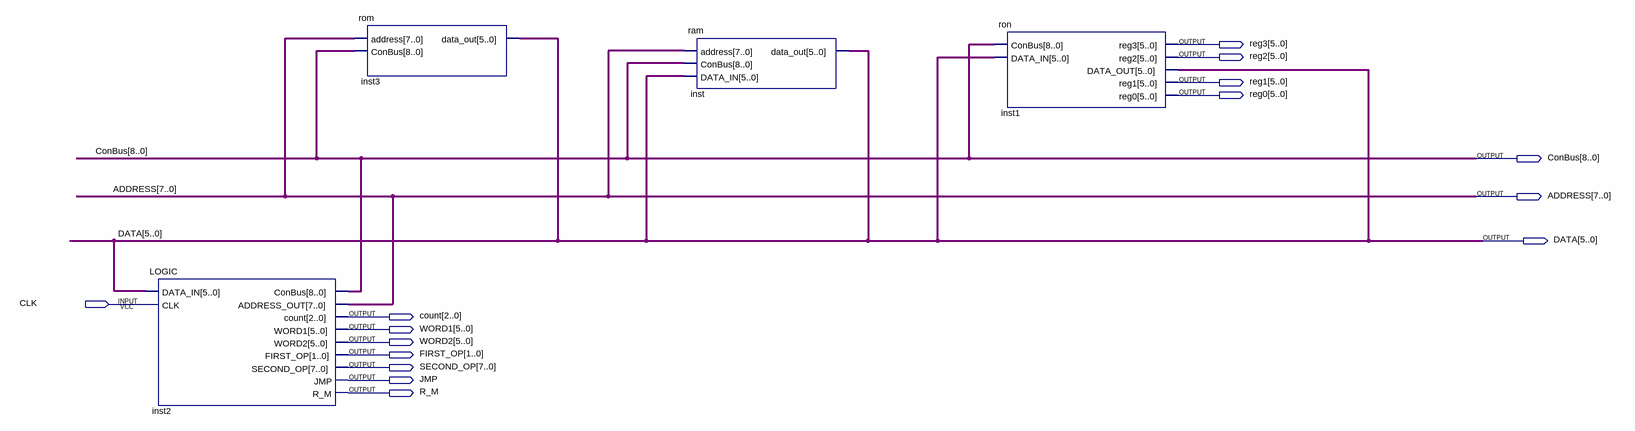
[diagram p0: schematic sheet]
// Quartus schematic main.bdf as structural Verilog: 4 symbols, 15 pins
module main (
  input  CLK,
  output [5:0] reg3,
  output [5:0] reg2,
  output [5:0] reg1,
  output [5:0] reg0,
  output [8:0] ConBus,
  output [7:0] ADDRESS,
  output [5:0] DATA,
  output [2:0] count,
  output [5:0] WORD1,
  output [5:0] WORD2,
  output [1:0] FIRST_OP,
  output [7:0] SECOND_OP,
  output JMP,
  output R_M
);

  LOGIC inst2 (
    .DATA_IN(DATA), .CLK(CLK), .ConBus(ConBus), .ADDRESS_OUT(ADDRESS), .count(count), .WORD1(WORD1),
    .WORD2(WORD2), .FIRST_OP(FIRST_OP), .SECOND_OP(SECOND_OP), .JMP(JMP), .R_M(R_M));
  rom inst3 (.address(ADDRESS), .ConBus(ConBus), .data_out(DATA));
  ram inst (.address(ADDRESS), .ConBus(ConBus), .DATA_IN(DATA), .data_out(DATA));
  ron inst1 (.ConBus(ConBus), .DATA_IN(DATA), .reg3(reg3), .reg2(reg2), .DATA_OUT(DATA), .reg1(reg1), .reg0(reg0));
endmodule
